# Altium schematic sheet LPDDR4X_Channel_B.SchDoc
size A4; SheetNumber: 15; SheetTotal: 36
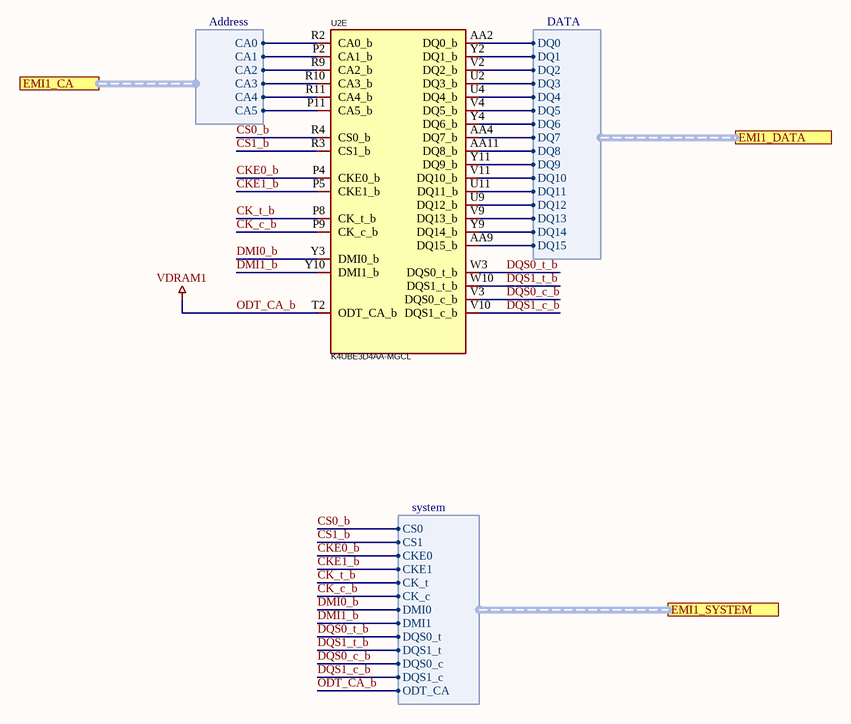
[diagram p0: LPDDR4X_Channel_B.SchDoc]

## Parts
U2  K4UBE3D4AA-MGCL  [K4F8E304HB-MGCJ]  (part E of 5)

## Ports
EMI1_CA (harness Address, see LPDDR4X[6000,7400], LPDDR4X[7020,7400], MT8365[2420,6200], MT8365_DDR4X[7500,4500]), EMI1_DATA (harness DATA, see LPDDR4X[6000,7900], LPDDR4X[7000,7900], MT8365[2300,6580], MT8365_DDR4X[7800,7200]), EMI1_SYSTEM (harness system, see LPDDR4X[6000,6900], LPDDR4X[7000,6900], MT8365[2200,5720], MT8365_DDR4X[8200,1300])

## Harnesses
DATA: DQ0, DQ1, DQ2, DQ3, DQ4, DQ5, DQ6, DQ7, DQ8, DQ9, DQ10, DQ11, DQ12, DQ13, DQ14, DQ15
Address: CA0, CA1, CA2, CA3, CA4, CA5
system: CS0, CS1, CKE0, CKE1, CK_t, CK_c, DMI0, DMI1, DQS0_t, DQS1_t, DQS0_c, DQS1_c, ODT_CA

## Nets
ODT_CA_b: U2.T2(ODT_CA_b) ; port EMI1_SYSTEM.ODT_CA  [also labelled VDRAM1]
CK_c_b: U2.P9(CK_c_b) ; port EMI1_SYSTEM.CK_c
CK_t_b: U2.P8(CK_t_b) ; port EMI1_SYSTEM.CK_t
CKE0_b: U2.P4(CKE0_b) ; port EMI1_SYSTEM.CKE0
CKE1_b: U2.P5(CKE1_b) ; port EMI1_SYSTEM.CKE1
CS0_b: U2.R4(CS0_b) ; port EMI1_SYSTEM.CS0
CS1_b: U2.R3(CS1_b) ; port EMI1_SYSTEM.CS1
DMI0_b: U2.Y3(DMI0_b) ; port EMI1_SYSTEM.DMI0
DMI1_b: U2.Y10(DMI1_b) ; port EMI1_SYSTEM.DMI1
DQS0_c_b: U2.V3(DQS0_c_b) ; port EMI1_SYSTEM.DQS0_c
DQS0_t_b: U2.W3(DQS0_t_b) ; port EMI1_SYSTEM.DQS0_t
DQS1_c_b: U2.V10(DQS1_c_b) ; port EMI1_SYSTEM.DQS1_c
DQS1_t_b: U2.W10(DQS1_t_b) ; port EMI1_SYSTEM.DQS1_t
NetU2_AA2: U2.AA2(DQ0_b) ; port EMI1_DATA.DQ0
NetU2_AA4: U2.AA4(DQ7_b) ; port EMI1_DATA.DQ7
NetU2_AA9: U2.AA9(DQ15_b) ; port EMI1_DATA.DQ15
NetU2_AA11: U2.AA11(DQ8_b) ; port EMI1_DATA.DQ8
NetU2_P2: U2.P2(CA1_b) ; port EMI1_CA.CA1
NetU2_P11: U2.P11(CA5_b) ; port EMI1_CA.CA5
NetU2_R2: U2.R2(CA0_b) ; port EMI1_CA.CA0
NetU2_R9: U2.R9(CA2_b) ; port EMI1_CA.CA2
NetU2_R10: U2.R10(CA3_b) ; port EMI1_CA.CA3
NetU2_R11: U2.R11(CA4_b) ; port EMI1_CA.CA4
NetU2_U2: U2.U2(DQ3_b) ; port EMI1_DATA.DQ3
NetU2_U4: U2.U4(DQ4_b) ; port EMI1_DATA.DQ4
NetU2_U9: U2.U9(DQ12_b) ; port EMI1_DATA.DQ12
NetU2_U11: U2.U11(DQ11_b) ; port EMI1_DATA.DQ11
NetU2_V2: U2.V2(DQ2_b) ; port EMI1_DATA.DQ2
NetU2_V4: U2.V4(DQ5_b) ; port EMI1_DATA.DQ5
NetU2_V9: U2.V9(DQ13_b) ; port EMI1_DATA.DQ13
NetU2_V11: U2.V11(DQ10_b) ; port EMI1_DATA.DQ10
NetU2_Y2: U2.Y2(DQ1_b) ; port EMI1_DATA.DQ1
NetU2_Y4: U2.Y4(DQ6_b) ; port EMI1_DATA.DQ6
NetU2_Y9: U2.Y9(DQ14_b) ; port EMI1_DATA.DQ14
NetU2_Y11: U2.Y11(DQ9_b) ; port EMI1_DATA.DQ9

## Library data of the parts
U2 = K4UBE3D4AA-MGCL: Integrated Circuit; Manufacturer: SAMSUNG(三星半导体); Add into BOM: yes; Memory Format: SDRAM LPDDR4X; Clock Frequency (fc): 2133MHz; Memory Size: 32Gbit; Supply Voltage: 1.7V~1.95V; Symbol: K4UBE3D4AA-MGCL; Device: K4UBE3D4AA-MGCL; LCSC Part Name: K4UBE3D4AA-MGCL 停产; Supplier Part: C2920257; Manufacturer Part: K4UBE3D4AA-MGCL; Supplier Footprint: FBGA-200; JLCPCB Part Class: Extended Part; Datasheet: https://atta.szlcsc.com/upload/public/pdf/source/20231024/5530CB18C2033A14DEC9B3A35E728586.pdf; Supplier: LCSC; Convert to PCB: yes; Supply current: -; Refresh Current: -; Operating Temperature: -25℃~+85℃